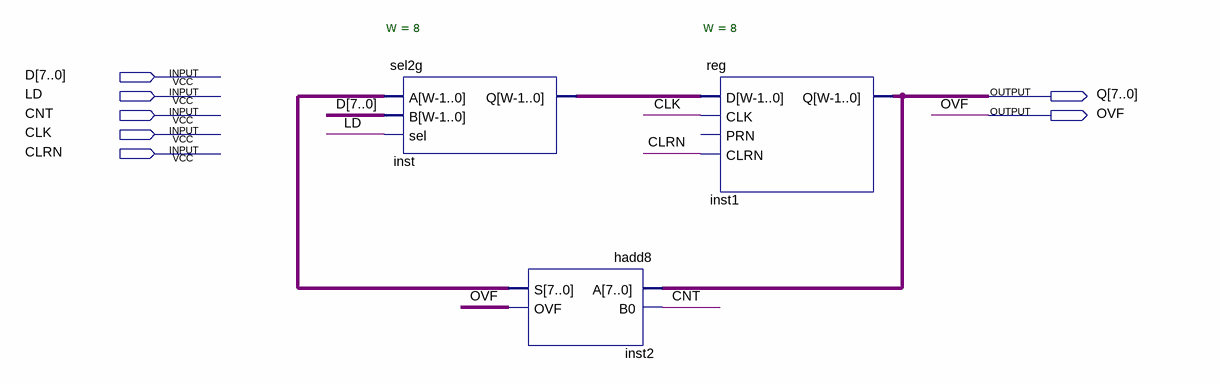
[diagram p0: schematic sheet]
// Quartus schematic cnt8.bdf as structural Verilog: 3 symbols, 7 pins
module cnt8 (
  input  [7:0] D,
  input  LD,
  input  CNT,
  input  CLK,
  input  CLRN,
  output [7:0] Q,
  output OVF
);

  wire [7:0] inst2_s, inst_q;

  sel2g #(.W(8)) inst (.A(inst2_s), .B(D), .sel(LD), .Q(inst_q));
  hadd8 inst2 (.A(Q), .B0(CNT), .S(inst2_s), .OVF(OVF));
  \reg  #(.W(8)) inst1 (.D(inst_q), .CLK(CLK), .CLRN(CLRN), .Q(Q));  // open: PRN
endmodule
